# Altium schematic sheet FLATSATAT.SchDoc: Title Block Template
size A3; Engineer: M. BRINDLEY; Organization: BLUEsat Project; Address1: Room 419; Address2: School of EE&T; Address3: UNSW, NSW 2052; Address4: Australia; DocumentNumber: TITL0001; Description: Sample Title Block; Version: 1.0
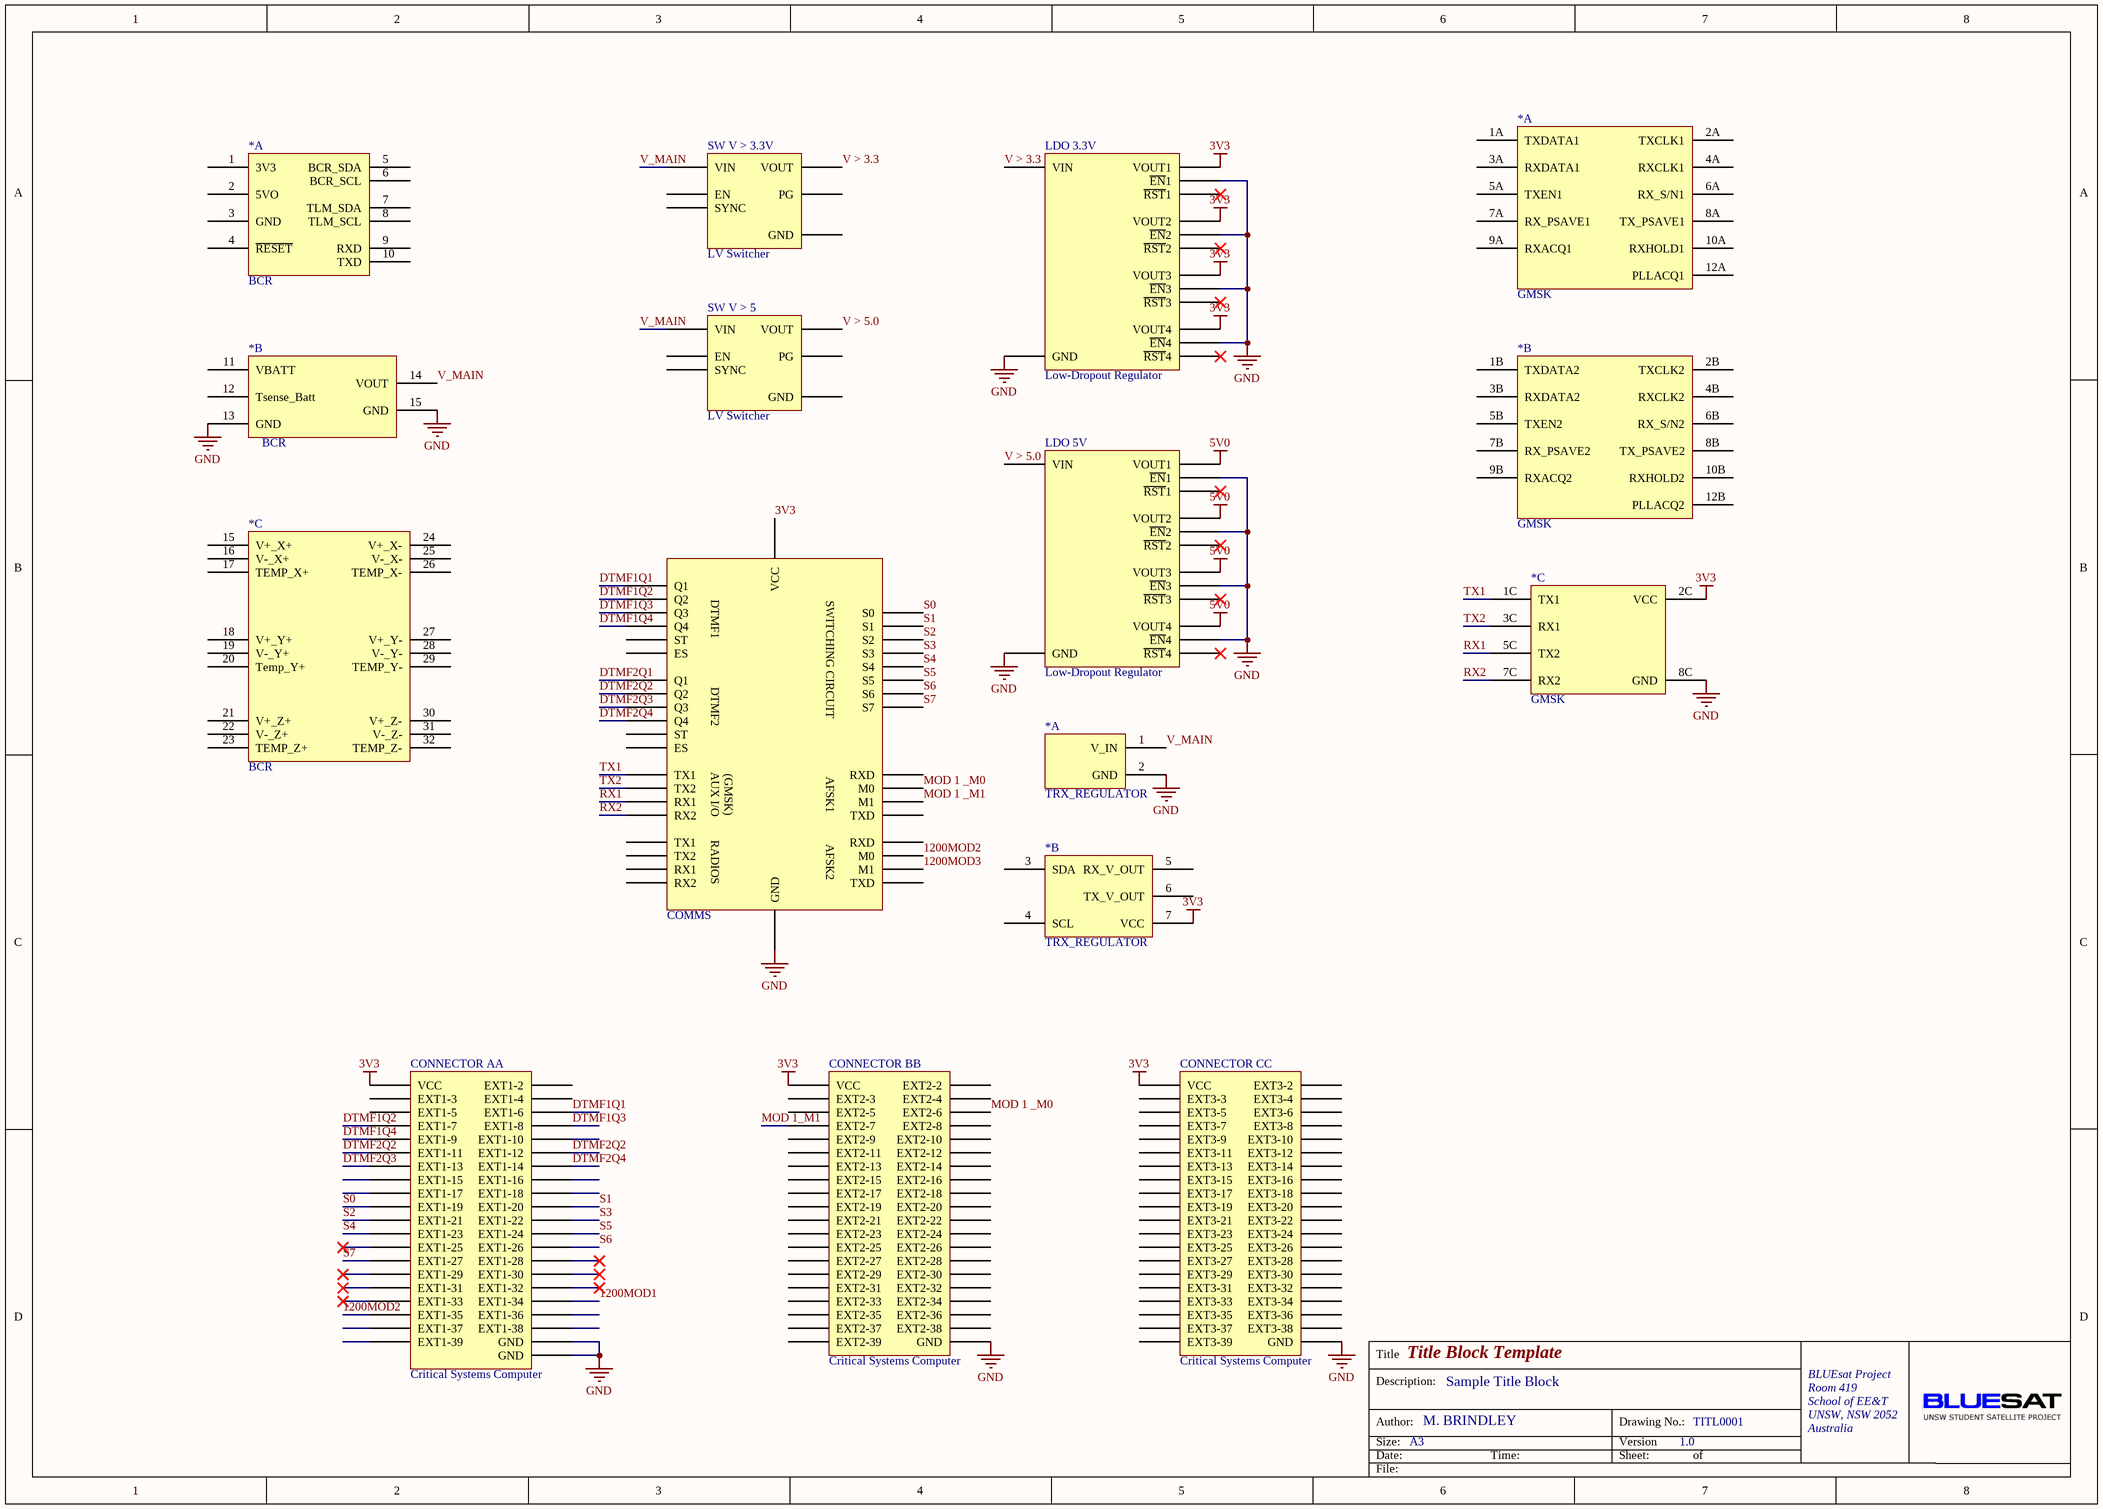
[diagram p0: FLATSATAT.SchDoc]

## Parts
(Parts that share a designator on the sheet are numbered #1, #2 ... from top to bottom, then left to right.)
*#1  BCR  (part A of 3)
*#2  GMSK  [GMSK]  (part A of 3)
*#3  BCR  (part B of 3)
*#4  GMSK  [GMSK]  (part B of 3)
*#5  GMSK  [GMSK]  (part C of 3)
*#6  BCR  (part C of 3)
*#7  TRX_REGULATOR  [TRX_REGULATOR]  (part A of 2)
*#8  TRX_REGULATOR  [TRX_REGULATOR]  (part B of 2)
B*  COMMS  [Communications]
CONNECTOR_A  Critical Systems Computer  [CSC]  (part A of 3)
CONNECTOR_B  Critical Systems Computer  [CSC]  (part B of 3)
CONNECTOR_C  Critical Systems Computer  [CSC]  (part C of 3)
LDO_3.3V  Low-Dropout Regulator  [LDO]
LDO_5V  Low-Dropout Regulator  [LDO]
SW_V_>_3.3V  LV Switcher  [LVSwitcher]
SW_V_>_5  LV Switcher  [LVSwitcher]

## Nets
3V3: *#5.2C(VCC) *#8.7(VCC) B*.?1(VCC) CONNECTOR_A.C1_1(VCC) CONNECTOR_B.C2_1(VCC) CONNECTOR_C.C3_1(VCC) LDO_3.3V.VOUT1 LDO_3.3V.VOUT2 LDO_3.3V.VOUT3 LDO_3.3V.VOUT4
5V0: LDO_5V.VOUT1 LDO_5V.VOUT2 LDO_5V.VOUT3 LDO_5V.VOUT4
GND: *#3.13(GND) *#3.15(GND) *#5.8C(GND) *#7.2(GND) B*.GND CONNECTOR_A.C1_40(GND) CONNECTOR_A.GND CONNECTOR_B.C2_40(GND) CONNECTOR_C.C3_40(GND) LDO_3.3V.EN1(~{EN}1) LDO_3.3V.EN2(~{EN}2) LDO_3.3V.EN3(~{EN}3) LDO_3.3V.EN4(~{EN}4) LDO_3.3V.GND LDO_5V.EN1(~{EN}1) LDO_5V.EN2(~{EN}2) LDO_5V.EN3(~{EN}3) LDO_5V.EN4(~{EN}4) LDO_5V.GND
1200MOD1: CONNECTOR_A.C1_34(EXT1-34)
1200MOD2: B*.AFSK2_M0(M0) CONNECTOR_A.C1_35(EXT1-35)
1200MOD3: B*.AFSK2_M1(M1)
DTMF1Q1: B*.DTMF1_Q1(Q1) CONNECTOR_A.C1_6(EXT1-6)
DTMF1Q2: B*.DTMF1_Q2(Q2) CONNECTOR_A.C1_7(EXT1-7)
DTMF1Q3: B*.DTMF1_Q3(Q3) CONNECTOR_A.C1_8(EXT1-8)
DTMF1Q4: B*.DTMF1_Q4(Q4) CONNECTOR_A.C1_9(EXT1-9)
DTMF2Q1: B*.DTMF2_Q1(Q1)
DTMF2Q2: B*.DTMF2_Q2(Q2) CONNECTOR_A.C1_11(EXT1-11) CONNECTOR_A.C1_12(EXT1-12)
DTMF2Q3: B*.DTMF2_Q3(Q3) CONNECTOR_A.C1_13(EXT1-13)
DTMF2Q4: B*.DTMF2_Q4(Q4) CONNECTOR_A.C1_14(EXT1-14)
MOD 1 _M0: B*.AFSK1_M0(M0) CONNECTOR_B.C2_6(EXT2-6)
MOD 1 _M1: B*.AFSK1_M1(M1)
MOD 1_M1: CONNECTOR_B.C2_7(EXT2-7)
RX1: *#5.5C(TX2) B*.GMSK_RX1(RX1)
RX2: *#5.7C(RX2) B*.GMSK_RX2(RX2)
S0: B*.S0 CONNECTOR_A.C1_19(EXT1-19)
S1: B*.S1 CONNECTOR_A.C1_20(EXT1-20)
S2: B*.S2 CONNECTOR_A.C1_21(EXT1-21)
S3: B*.S3 CONNECTOR_A.C1_22(EXT1-22)
S4: B*.S4 CONNECTOR_A.C1_23(EXT1-23)
S5: B*.S5 CONNECTOR_A.C1_24(EXT1-24)
S6: B*.S6 CONNECTOR_A.C1_26(EXT1-26)
S7: B*.S7 CONNECTOR_A.C1_27(EXT1-27)
TX1: *#5.1C(TX1) B*.GMSK_TX1(TX1)
TX2: *#5.3C(RX1) B*.GMSK_TX2(TX2)
V > 3.3: LDO_3.3V.VIN SW_V_>_3.3V.Vout(VOUT)
V > 5.0: LDO_5V.VIN SW_V_>_5.Vout(VOUT)
V_MAIN: *#3.14(VOUT) *#7.1(V_IN) SW_V_>_3.3V.Vin(VIN) SW_V_>_5.Vin(VIN)

Not connected (* = marked no-connect by the designer): *#1 1(3V3) 2(5VO) 3(GND) 4(~{RESET}) 5(BCR_SDA) 6(BCR_SCL) 7(TLM_SDA) 8(TLM_SCL) 9(RXD) 10(TXD); *#2 1A(TXDATA1) 2A(TXCLK1) 3A(RXDATA1) 4A(RXCLK1) 5A(TXEN1) 6A(RX_S/N1) 7A(RX_PSAVE1) 8A(TX_PSAVE1) 9A(RXACQ1) 10A(RXHOLD1) 12A(PLLACQ1); *#3 11(VBATT) 12(Tsense_Batt); *#4 1B(TXDATA2) 2B(TXCLK2) 3B(RXDATA2) 4B(RXCLK2) 5B(TXEN2) 6B(RX_S/N2) 7B(RX_PSAVE2) 8B(TX_PSAVE2) 9B(RXACQ2) 10B(RXHOLD2) 12B(PLLACQ2); *#6 15(V+_X+) 16(V-_X+) 17(TEMP_X+) 18(V+_Y+) 19(V-_Y+) 20(Temp_Y+) 21(V+_Z+) 22(V-_Z+) 23(TEMP_Z+) 24(V+_X-) 25(V-_X-) 26(TEMP_X-) 27(V+_Y-) 28(V-_Y-) 29(TEMP_Y-) 30(V+_Z-) 31(V-_Z-) 32(TEMP_Z-); *#8 3(SDA) 4(SCL) 5(RX_V_OUT) 6(TX_V_OUT); B* AFSK1_RXD(RXD) AFSK1_TXD(TXD) AFSK2_RXD(RXD) AFSK2_TXD(TXD) DTMF1_ES(ES) DTMF1_ST(ST) DTMF2_ES(ES) DTMF2_ST(ST) RX2(RX1) TX1 TX2; CONNECTOR_A C1_2(EXT1-2) C1_3(EXT1-3) C1_4(EXT1-4) C1_5(EXT1-5) C1_10(EXT1-10) C1_15(EXT1-15) C1_16(EXT1-16) C1_17(EXT1-17) C1_18(EXT1-18) C1_25(EXT1-25)* C1_28(EXT1-28)* C1_29(EXT1-29)* C1_30(EXT1-30)* C1_31(EXT1-31)* C1_32(EXT1-32)* C1_33(EXT1-33)* C1_36(EXT1-36) C1_37(EXT1-37) C1_38(EXT1-38) C1_39(EXT1-39); CONNECTOR_B C2_2(EXT2-2) C2_3(EXT2-3) C2_4(EXT2-4) C2_5(EXT2-5) C2_8(EXT2-8) C2_9(EXT2-9) C2_10(EXT2-10) C2_11(EXT2-11) C2_12(EXT2-12) C2_13(EXT2-13) C2_14(EXT2-14) C2_15(EXT2-15) C2_16(EXT2-16) C2_17(EXT2-17) C2_18(EXT2-18) C2_19(EXT2-19) C2_20(EXT2-20) C2_21(EXT2-21) C2_22(EXT2-22) C2_23(EXT2-23) C2_24(EXT2-24) C2_25(EXT2-25) C2_26(EXT2-26) C2_27(EXT2-27) C2_28(EXT2-28) C2_29(EXT2-29) C2_30(EXT2-30) C2_31(EXT2-31) C2_32(EXT2-32) C2_33(EXT2-33) C2_34(EXT2-34) C2_35(EXT2-35) C2_36(EXT2-36) C2_37(EXT2-37) C2_38(EXT2-38) C2_39(EXT2-39); CONNECTOR_C C3_2(EXT3-2) C3_3(EXT3-3) C3_4(EXT3-4) C3_5(EXT3-5) C3_6(EXT3-6) C3_7(EXT3-7) C3_8(EXT3-8) C3_9(EXT3-9) C3_10(EXT3-10) C3_11(EXT3-11) C3_12(EXT3-12) C3_13(EXT3-13) C3_14(EXT3-14) C3_15(EXT3-15) C3_16(EXT3-16) C3_17(EXT3-17) C3_18(EXT3-18) C3_19(EXT3-19) C3_20(EXT3-20) C3_21(EXT3-21) C3_22(EXT3-22) C3_23(EXT3-23) C3_24(EXT3-24) C3_25(EXT3-25) C3_26(EXT3-26) C3_27(EXT3-27) C3_28(EXT3-28) C3_29(EXT3-29) C3_30(EXT3-30) C3_31(EXT3-31) C3_32(EXT3-32) C3_33(EXT3-33) C3_34(EXT3-34) C3_35(EXT3-35) C3_36(EXT3-36) C3_37(EXT3-37) C3_38(EXT3-38) C3_39(EXT3-39); LDO_3.3V RST1(~{RST}1)* RST2(~{RST}2)* RST3(~{RST}3)* RST4(~{RST}4)*; LDO_5V RST1(~{RST}1)* RST2(~{RST}2)* RST3(~{RST}3)* RST4(~{RST}4)*; SW_V_>_3.3V EN GND PG SYNC; SW_V_>_5 EN GND PG SYNC

## Notes on the sheet
- Title
- Description:
- Size:
- Author:
- Date:
- A3
- Time:
- Version
- Sheet:
- Drawing No.:
- of
- File:
- (in symbol COMMS) DTMF1; SWITCHING CIRCUIT; DTMF2; AUX I/O; (GMSK); AFSK1; RADIOS; AFSK2

## Library data of the parts
CONNECTOR_A CONNECTOR_B CONNECTOR_C = CSC
LDO_3.3V LDO_5V = LDO
SW_V_>_3.3V SW_V_>_5 = LVSWITCHER